# EAGLE design EPS Flatsat Module (EAGLE 9.5.1)

## Sheet 1 of 2
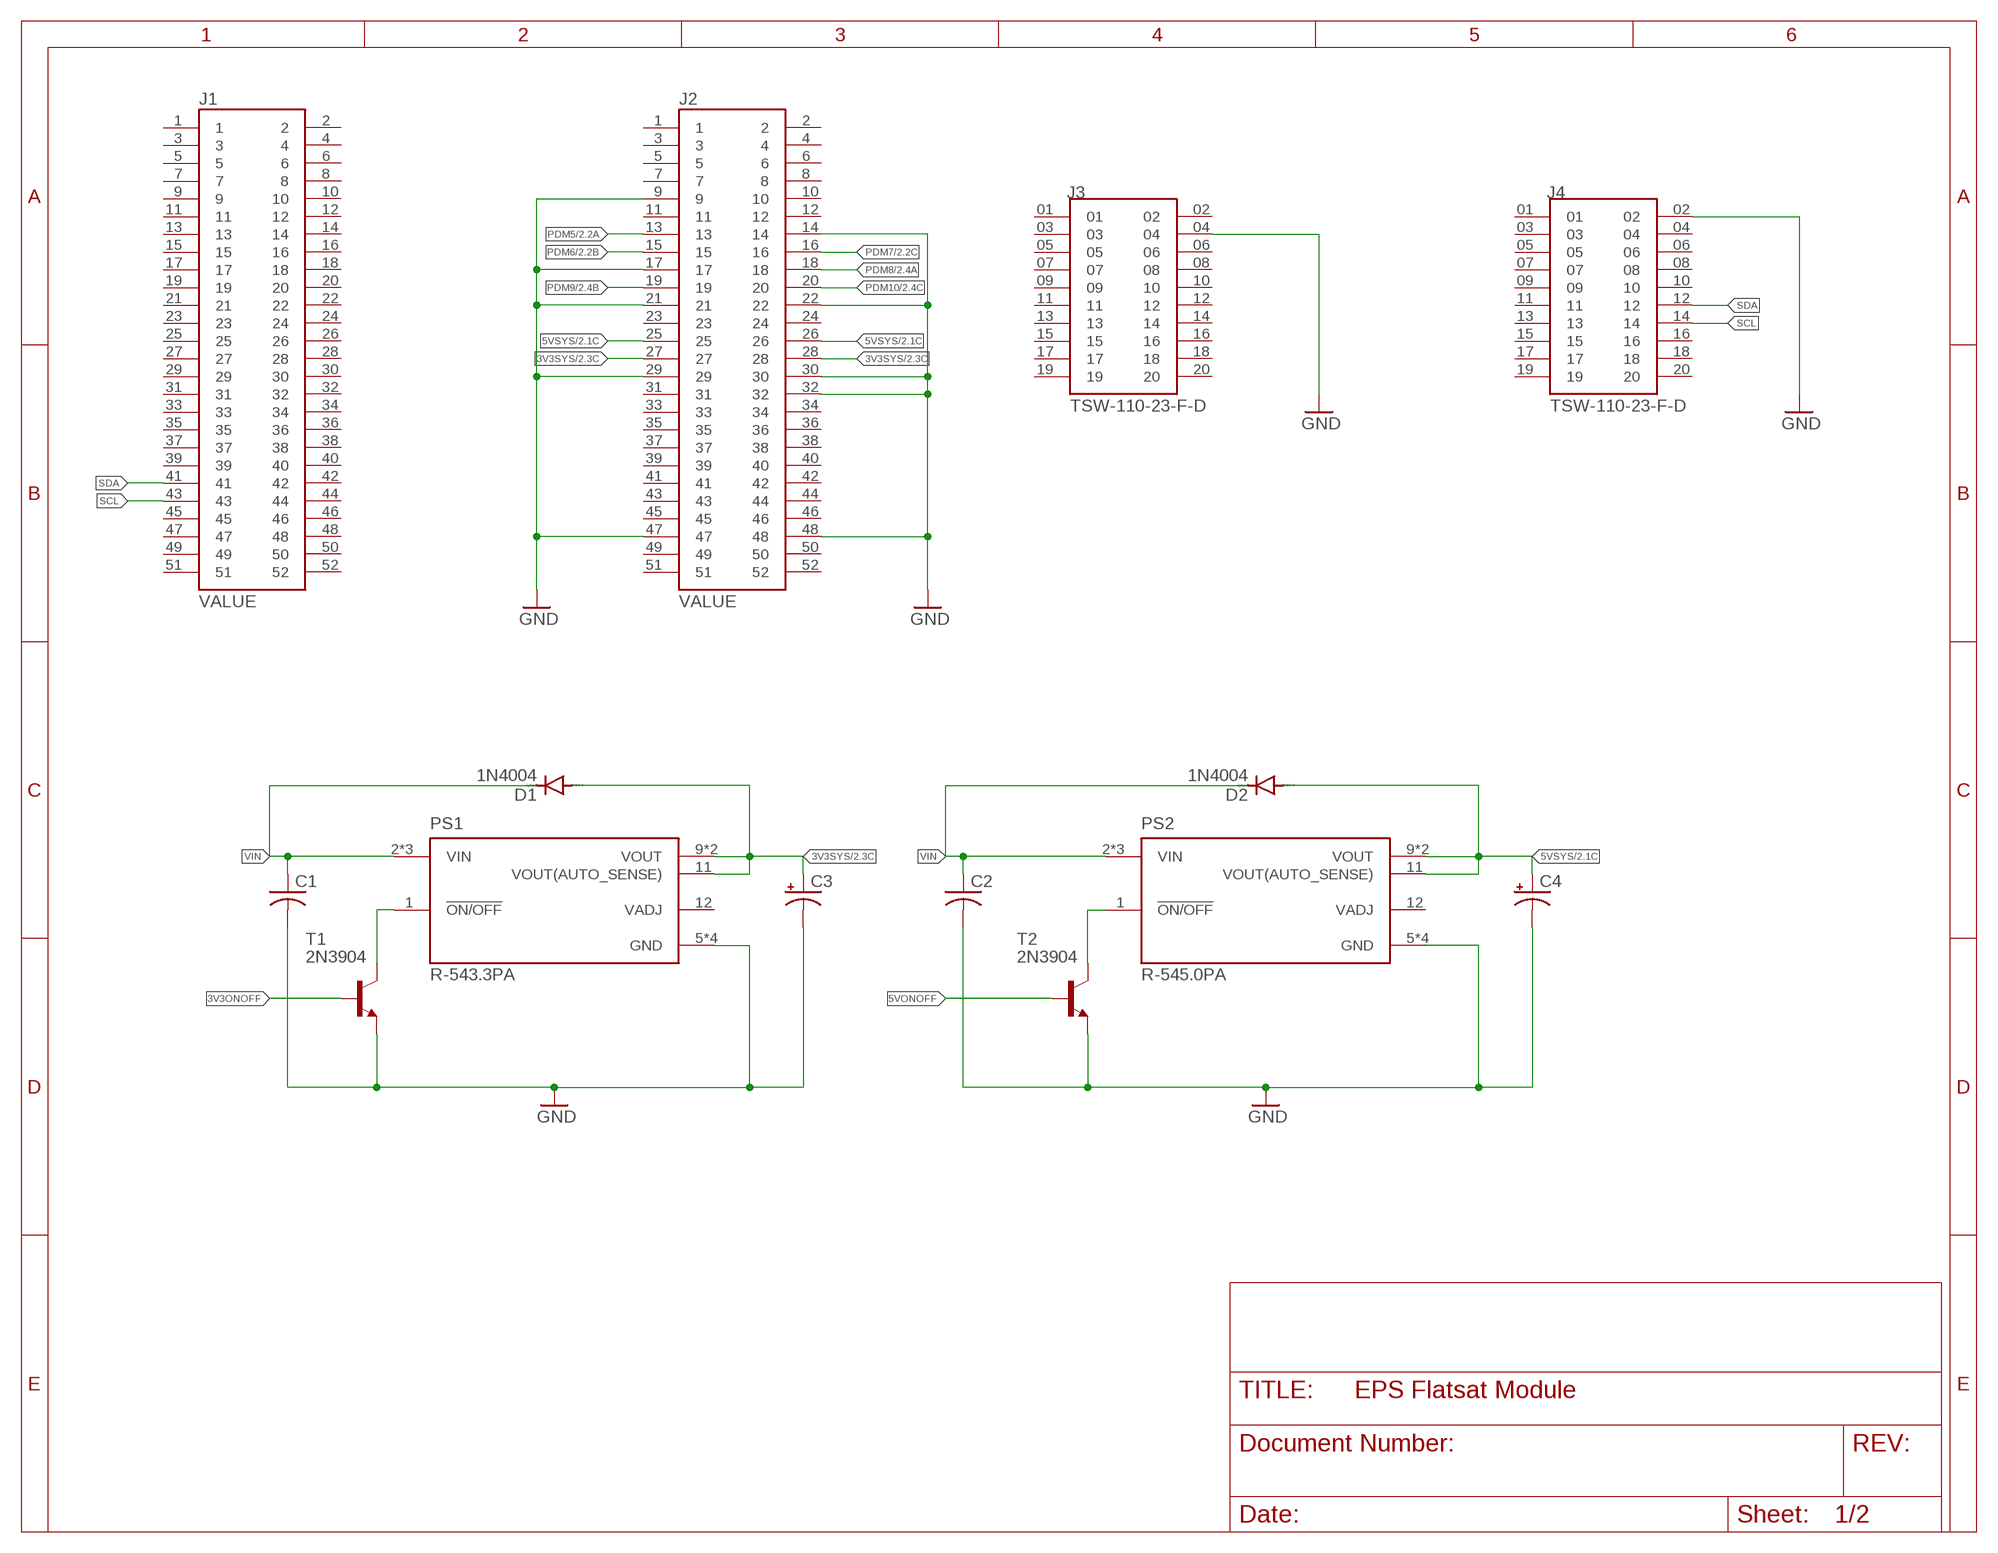
[diagram p0: schematic, sheet 1]

### Parts
C1  C-USC0805  [C0805]
C2  C-USC0805  [C0805]
C3  CPOL-USE2.5-6  [E2,5-6]
C4  CPOL-USE2.5-6  [E2,5-6]
D1  1N4004  [DO41-10]
D2  1N4004  [DO41-10]
J1  ESQ-126-39-G-D  [SAMTEC_ESQ-126-39-G-D]
J2  ESQ-126-39-G-D  [SAMTEC_ESQ-126-39-G-D]
J3  TSW-110-23-F-D  [SAMTEC_TSW-110-23-F-D]
J4  TSW-110-23-F-D  [SAMTEC_TSW-110-23-F-D]
PS1  R-543.3PA  [CONV_R-543.3PA]
PS2  R-545.0PA  [CONV_R-545.0PA]
T1  2N3904  [TO92]
T2  2N3904  [TO92]

### Nets
3V3ONOFF: T1.2(B)
3V3SYS: C3.+ D1.A J2.27 J2.28 PS1.9(VOUT) PS1.10(VOUT) PS1.11(VOUT(AUTO_SENSE)) ; also sheet 2
5VONOFF: T2.2(B)
5VSYS: C4.+ D2.A J2.25 J2.26 PS2.9(VOUT) PS2.10(VOUT) PS2.11(VOUT(AUTO_SENSE)) ; also sheet 2
GND: C1.2 C2.2 C3.- C4.- J2.9 J2.14 J2.17 J2.21 J2.22 J2.29 J2.30 J2.32 J2.47 J2.48 J3.04 J4.02 PS1.5(GND) PS1.6(GND) PS1.7(GND) PS1.8(GND) PS2.5(GND) PS2.6(GND) PS2.7(GND) PS2.8(GND) T1.3(E) T2.3(E) ; also sheet 2
N$1: PS1.1(!ON/OFF) T1.1(C)
N$2: PS2.1(!ON/OFF) T2.1(C)
PDM5: J2.13 ; also sheet 2
PDM6: J2.15 ; also sheet 2
PDM7: J2.16 ; also sheet 2
PDM8: J2.18 ; also sheet 2
PDM9: J2.19 ; also sheet 2
PDM10: J2.20 ; also sheet 2
SCL: J1.43 J4.14
SDA: J1.41 J4.12
VIN: C1.1 C2.1 D1.C D2.C PS1.2(VIN) PS1.3(VIN) PS1.4(VIN) PS2.2(VIN) PS2.3(VIN) PS2.4(VIN)
Unconnected: J1.1 J1.2 J1.3 J1.4 J1.5 J1.6 J1.7 J1.8 J1.9 J1.10 J1.11 J1.12 J1.13 J1.14 J1.15 J1.16 J1.17 J1.18 J1.19 J1.20 J1.21 J1.22 J1.23 J1.24 J1.25 J1.26 J1.27 J1.28 J1.29 J1.30 J1.31 J1.32 J1.33 J1.34 J1.35 J1.36 J1.37 J1.38 J1.39 J1.40 J1.42 J1.44 J1.45 J1.46 J1.47 J1.48 J1.49 J1.50 J1.51 J1.52 J2.1 J2.2 J2.3 J2.4 J2.5 J2.6 J2.7 J2.8 J2.10 J2.11 J2.12 J2.23 J2.24 J2.31 J2.33 J2.34 J2.35 J2.36 J2.37 J2.38 J2.39 J2.40 J2.41 J2.42 J2.43 J2.44 J2.45 J2.46 J2.49 J2.50 J2.51 J2.52 J3.01 J3.02 J3.03 J3.05 J3.06 J3.07 J3.08 J3.09 J3.10 J3.11 J3.12 J3.13 J3.14 J3.15 J3.16 J3.17 J3.18 J3.19 J3.20 J4.01 J4.03 J4.04 J4.05 J4.06 J4.07 J4.08 J4.09 J4.10 J4.11 J4.13 J4.15 J4.16 J4.17 J4.18 J4.19 J4.20 PS1.12(VADJ) PS2.12(VADJ)

## Sheet 2 of 2
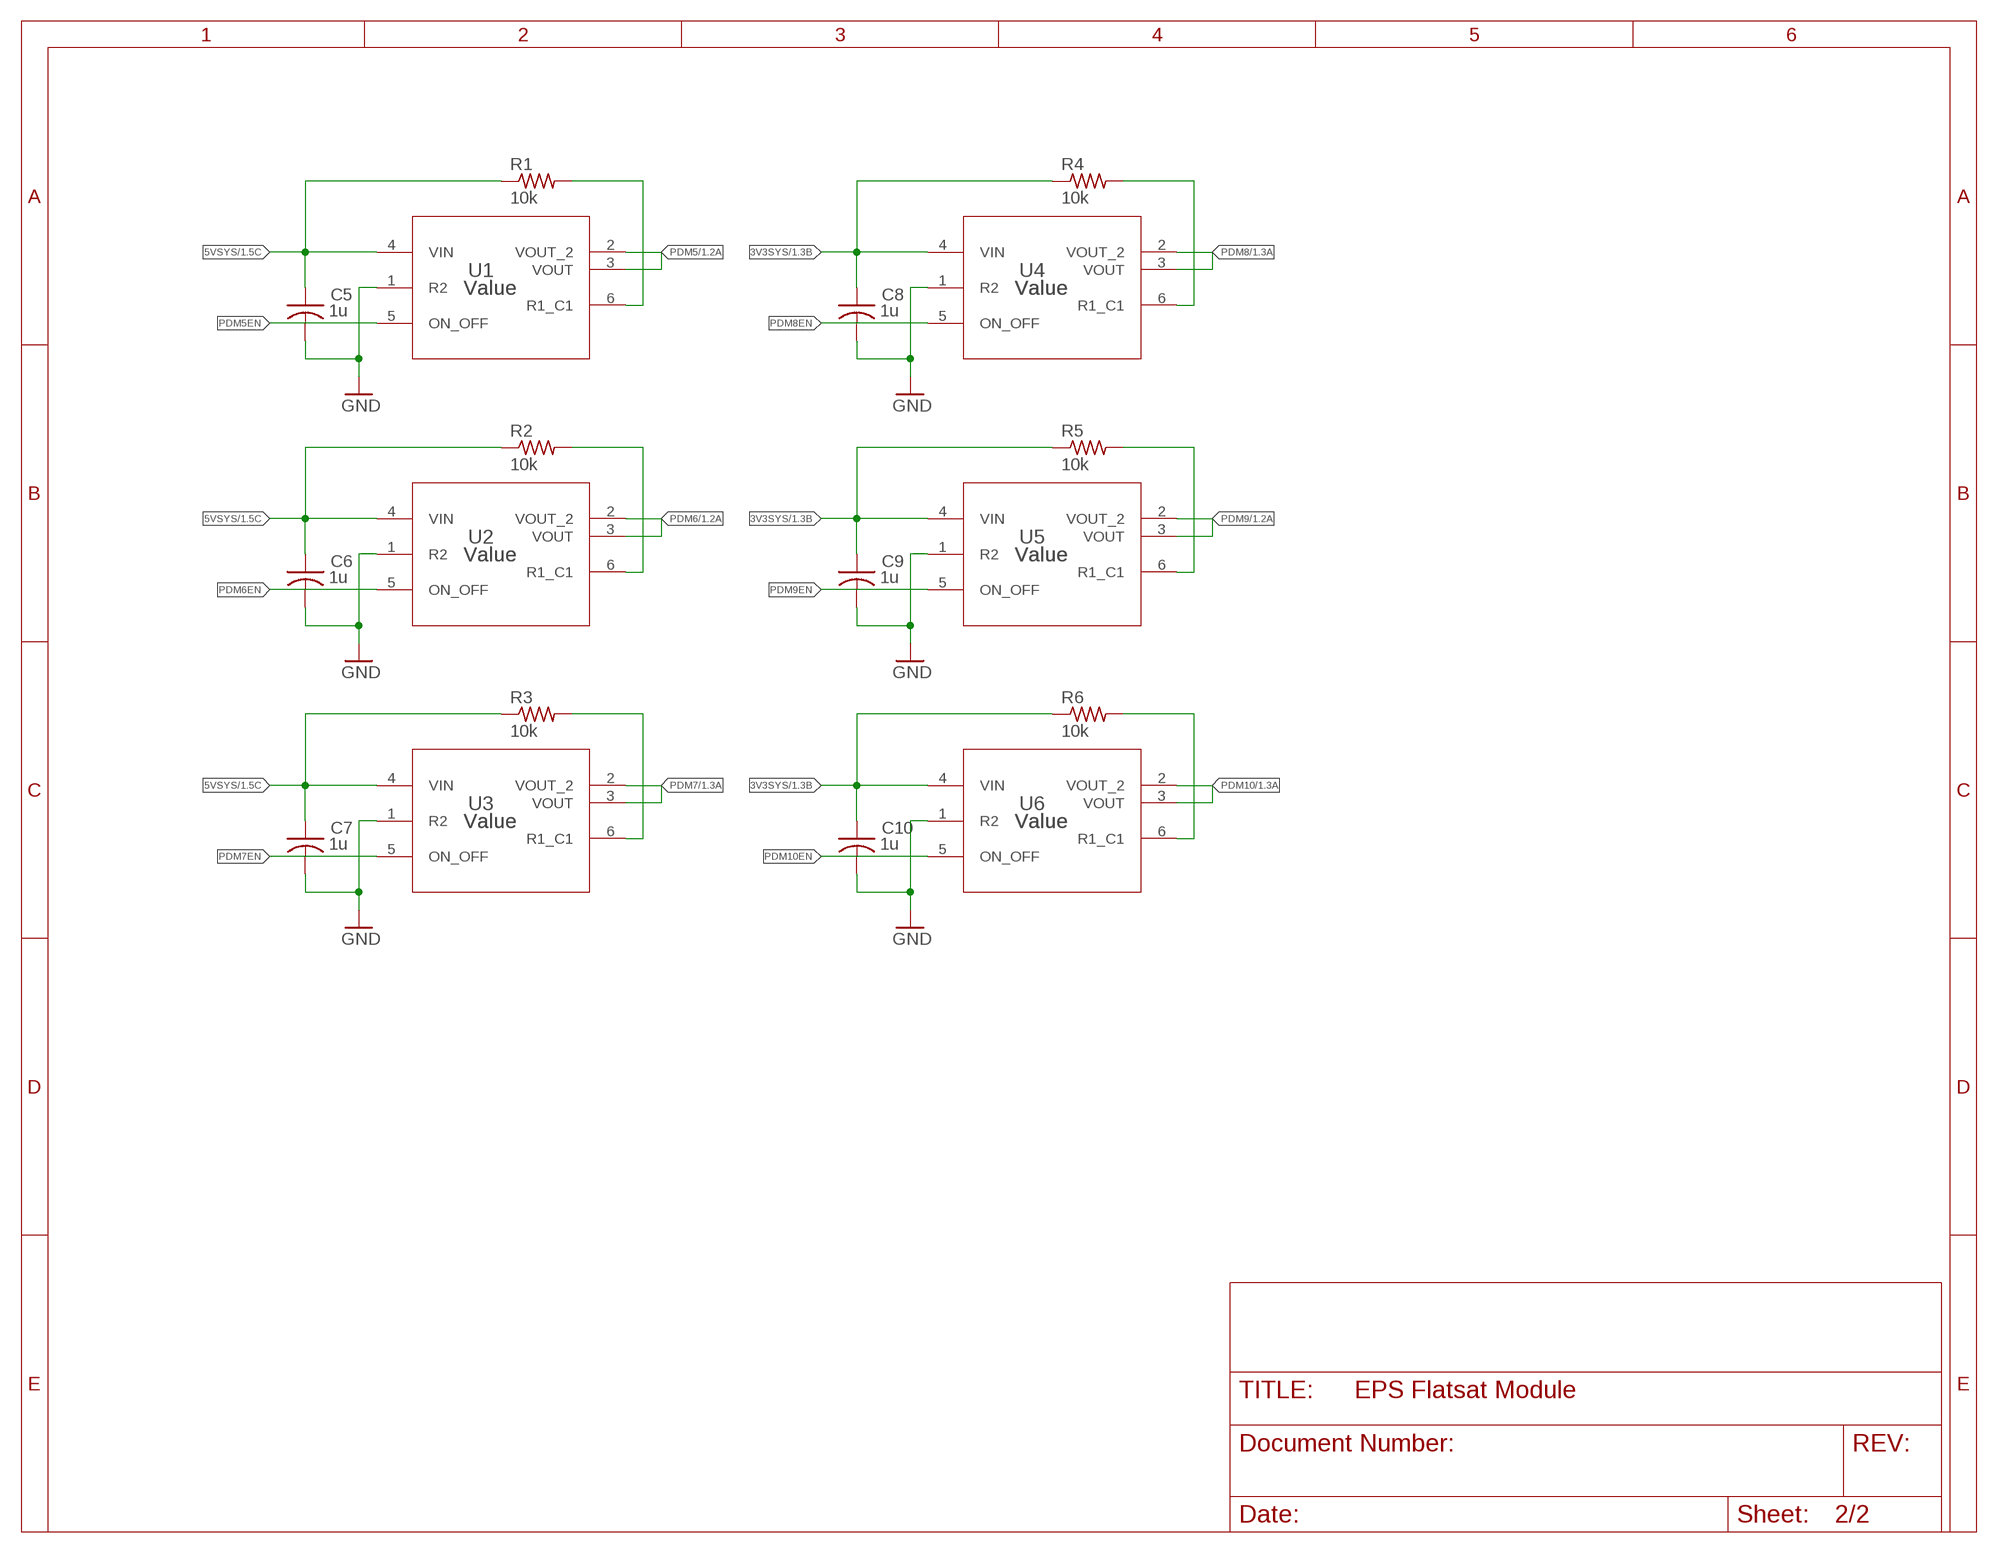
[diagram p1: schematic, sheet 2]

### Parts
C5  1u  C-USC0805  [C0805]
C6  1u  C-USC0805  [C0805]
C7  1u  C-USC0805  [C0805]
C8  1u  C-USC0805  [C0805]
C9  1u  C-USC0805  [C0805]
C10  1u  C-USC0805  [C0805]
R1  10k  R-US_R0805  [R0805]
R2  10k  R-US_R0805  [R0805]
R3  10k  R-US_R0805  [R0805]
R4  10k  R-US_R0805  [R0805]
R5  10k  R-US_R0805  [R0805]
R6  10k  R-US_R0805  [R0805]
U1  Value  TPS27081ADDCR  [DDC0006A_N]
U2  Value  TPS27081ADDCR  [DDC0006A_N]
U3  Value  TPS27081ADDCR  [DDC0006A_N]
U4  Value  TPS27081ADDCR  [DDC0006A_N]
U5  Value  TPS27081ADDCR  [DDC0006A_N]
U6  Value  TPS27081ADDCR  [DDC0006A_N]

### Nets
3V3SYS: C8.1 C9.1 C10.1 R4.1 R5.1 R6.1 U4.4(VIN) U5.4(VIN) U6.4(VIN) ; also sheet 1
5VSYS: C5.1 C6.1 C7.1 R1.1 R2.1 R3.1 U1.4(VIN) U2.4(VIN) U3.4(VIN) ; also sheet 1
GND: C5.2 C6.2 C7.2 C8.2 C9.2 C10.2 U1.1(R2) U2.1(R2) U3.1(R2) U4.1(R2) U5.1(R2) U6.1(R2) ; also sheet 1
N$3: R1.2 U1.6(R1_C1)
N$4: R2.2 U2.6(R1_C1)
N$5: R3.2 U3.6(R1_C1)
N$6: R4.2 U4.6(R1_C1)
N$7: R5.2 U5.6(R1_C1)
N$8: R6.2 U6.6(R1_C1)
PDM5: U1.2(VOUT_2) U1.3(VOUT) ; also sheet 1
PDM5EN: U1.5(ON_OFF)
PDM6: U2.2(VOUT_2) U2.3(VOUT) ; also sheet 1
PDM6EN: U2.5(ON_OFF)
PDM7: U3.2(VOUT_2) U3.3(VOUT) ; also sheet 1
PDM7EN: U3.5(ON_OFF)
PDM8: U4.2(VOUT_2) U4.3(VOUT) ; also sheet 1
PDM8EN: U4.5(ON_OFF)
PDM9: U5.2(VOUT_2) U5.3(VOUT) ; also sheet 1
PDM9EN: U5.5(ON_OFF)
PDM10: U6.2(VOUT_2) U6.3(VOUT) ; also sheet 1
PDM10EN: U6.5(ON_OFF)

## Library data of the parts
C1 C2 C5-C10 = rcl:C-US: CAPACITOR, American symbol; SPICEPREFIX: C
C3 C4 = rcl:CPOL-US: POLARIZED CAPACITOR, American symbol; SPICEPREFIX: C
D1 D2 = diode:1N4004: DIODE general purpose rectifier, 1 A
J1 J2 = ESQ-126-39-G-D:ESQ-126-39-G-D: Conn Elevated Socket SKT 52 POS 2.54mm Solder ST Thru-Hole Tube; DESCRIPTION: 52 Position Elevated Socket Connector Through Hole; DIGI-KEY_PART_NUMBER: SAM10462-ND; DIGI-KEY_PURCHASE_URL: https://www.digikey.com/product-detail/en/samtec-inc/ESQ-126-39-G-D/SAM10462-ND/3601055?utm_source=snapeda&utm_medium=aggregator&utm_campaign=symbol; MF: Samtec; MP: ESQ-126-39-G-D; PACKAGE: None
J3 J4 = TSW-110-23-F-D:TSW-110-23-F-D; MANUFACTURER: Samtec; PARTREV: R; STANDARD: Manufacturer Recommendations
PS1 = R-543.3PA:R-543.3PA: 2,3,4,5 Amp SIP12 Vertical & Horizontal Single Output; DESCRIPTION: 4A DC/DC-Converter 'INNOLINE' SIP12 reg; DIGI-KEY_PART_NUMBER: 945-1599-5-ND; DIGIKEY-PURCHASE-URL: https://snapeda.com/shop?store=DigiKey&id=3630570; MF: Recom Power; MP: R-543.3PA; PACKAGE: SIP-12 Recom Power
PS2 = R-545.0PA:R-545.0PA: 2,3,4,5 Amp SIP12 Vertical & Horizontal Single Output; DESCRIPTION: 4A DC/DC-Converter 'INNOLINE' SIP12 reg; DIGI-KEY_PART_NUMBER: R-545.0PA-ND; MF: Recom Power; MP: R-545.0PA; PACKAGE: SIP-12 Recom Power
R1-R6 = rcl:R-US_: RESISTOR, American symbol; SPICEPREFIX: R
T1 T2 = transistor:2N3904: NPN TRANSISTOR
U1-U6 = TPS27081ADDCR:TPS27081ADDCR; APPLICATION_BUILDNUMBER: *; COMPTYPE: IC; MANUFACTURER: Texas Instruments; MOUNTTYPE: SMT; PACKAGEREFERENCE: DDC0006A; PARTNUMBER: TPS27081ADDCR; PIN_COUNT: 6; REFDES: RefDes; ROHS: Y; TYPE: TYPE

## Board
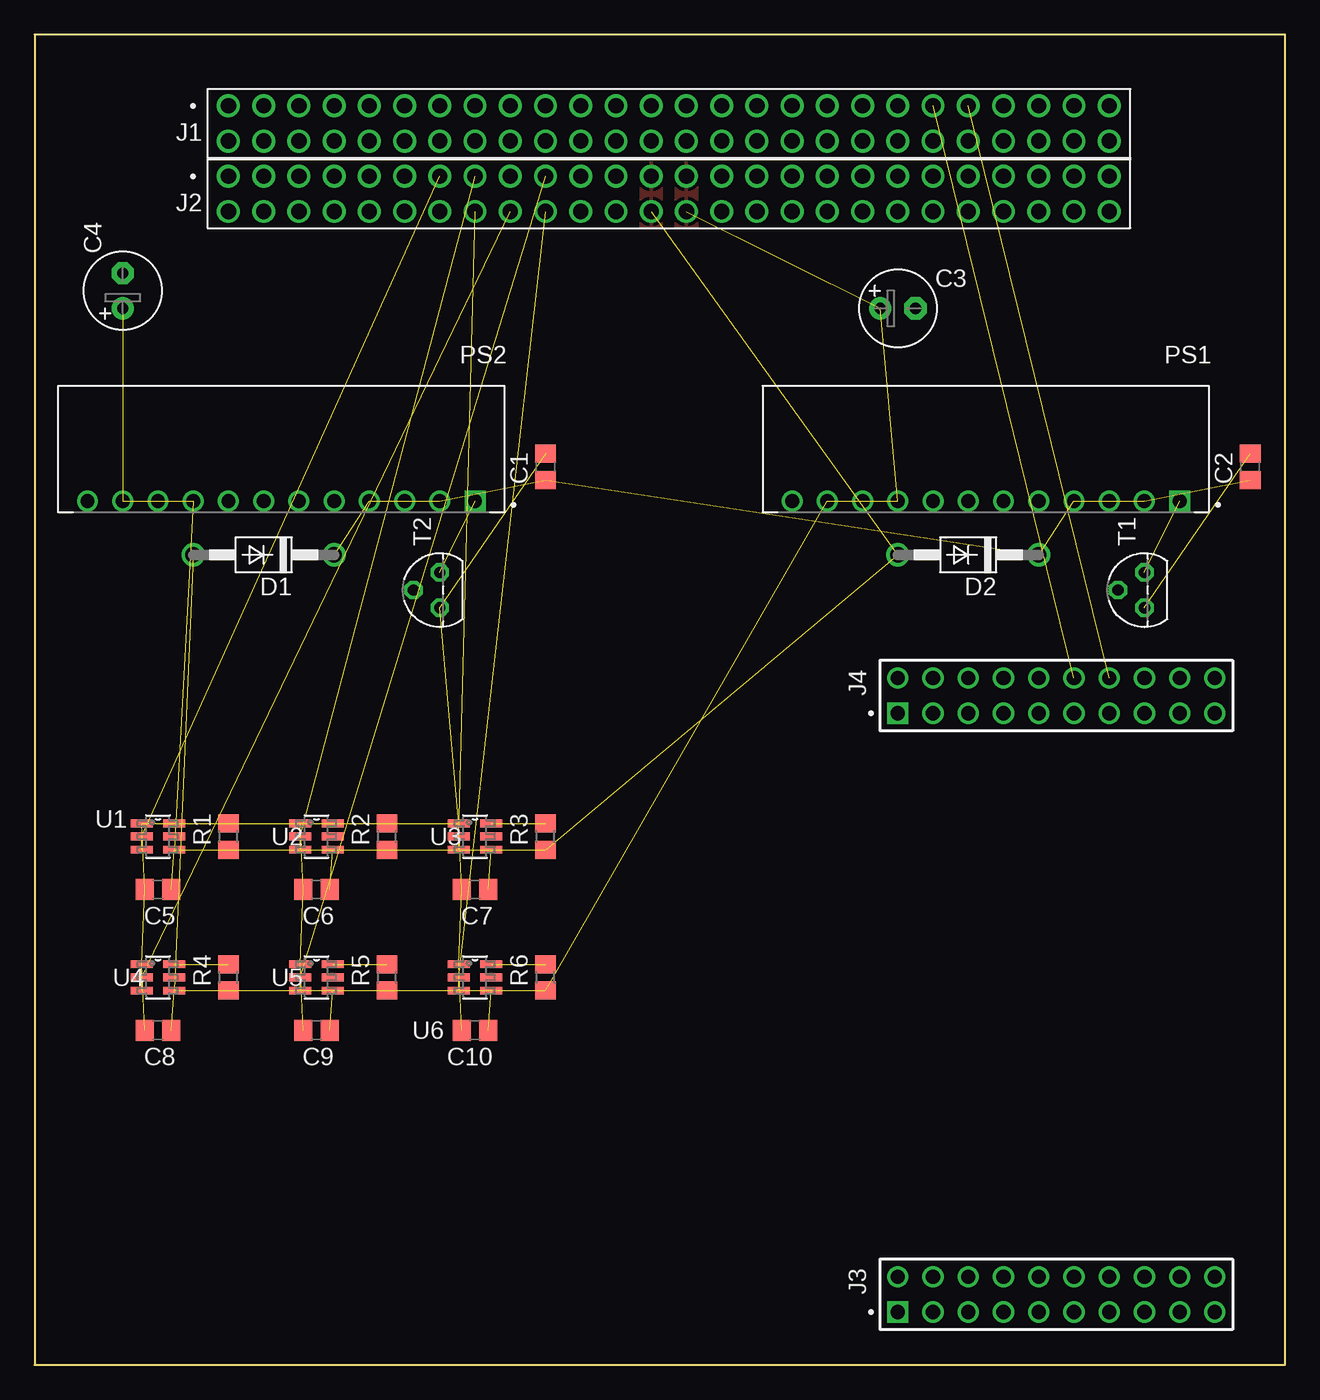
[diagram p2: board, top side]
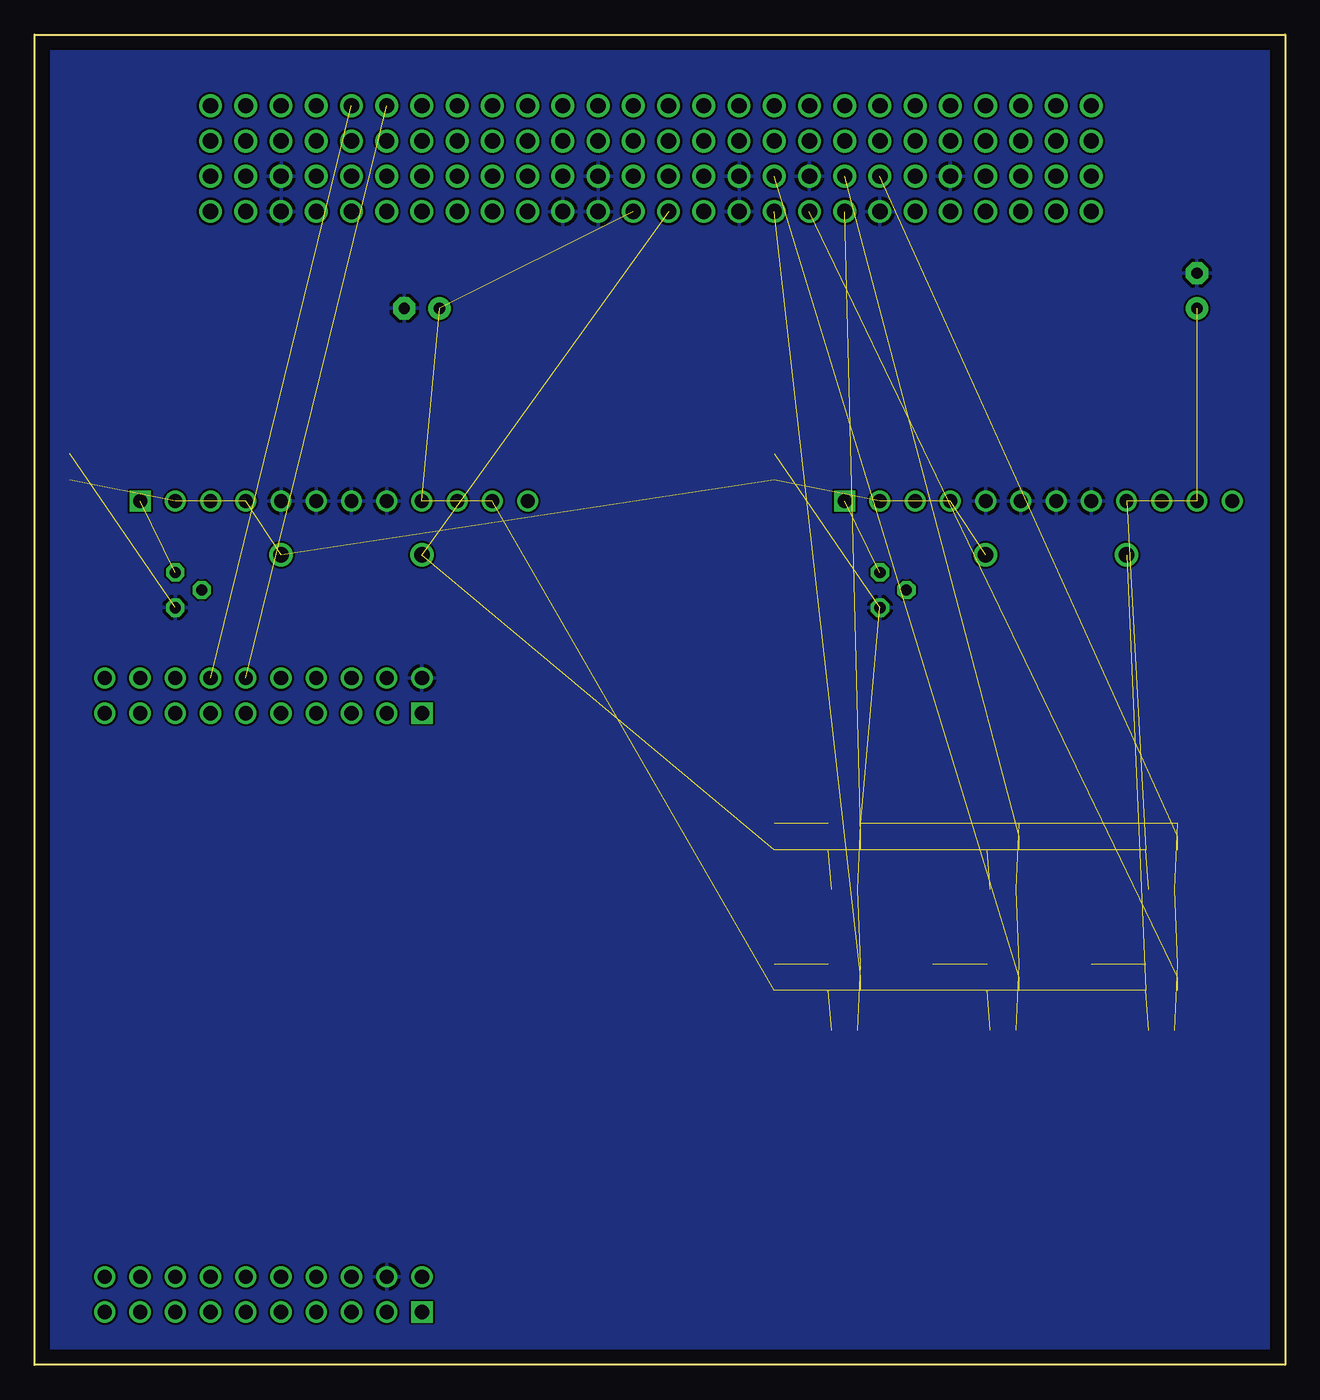
[diagram p3: board, bottom side, seen from below]

Size 90.15 x 95.94 mm. Coordinates in mm from the lower left corner, seen from the top.
Outline: 0,95.94 0,0 90.15,0 90.15,95.94 0,95.94
Copper layers (1*16): Top 0.035mm / dielectric 1.5mm / Bottom 0.035mm
Design rules "default": minimum track width 6mil, minimum drill 0.35mm, track to track 6mil, track to pad 6mil, pad to pad 6mil, via to via 6mil, smd to smd 6mil, copper to edge 40mil, drill to drill 6mil, minimum pad ring 10mil, minimum via ring 8mil, stop-mask expansion 4mil, vias tented up to drill 0mil, thermal gap 10mil

### Footprints (pad centres in the part's own frame; a part is rotated, then mirrored left to right if it is on the bottom)
C0805 = smd 1.3 x 1.5: 1 -0.95,0; 2 0.95,0
E2,5-6 = drill 0.813 pad 1.6: + -1.27,0 | drill 0.813 pad 1.6 octagon: - 1.27,0
DO41-10 = drill 1.118: A 5.08,0; C -5.08,0
SAMTEC_ESQ-126-39-G-D = drill 1.1: 1 0,0; 2 0,-2.54; 3 2.54,0; 4 2.54,-2.54; 5 5.08,0; 6 5.08,-2.54; 7 7.62,0; 8 7.62,-2.54; 9 10.16,0; 10 10.16,-2.54; 11 12.7,0; 12 12.7,-2.54; 13 15.24,0; 14 15.24,-2.54; 15 17.78,0; 16 17.78,-2.54; 17 20.32,0; 18 20.32,-2.54; 19 22.86,0; 20 22.86,-2.54; 21 25.4,0; 22 25.4,-2.54; 23 27.94,0; 24 27.94,-2.54; 25 30.48,0; 26 30.48,-2.54; 27 33.02,0; 28 33.02,-2.54; 29 35.56,0; 30 35.56,-2.54; 31 38.1,0; 32 38.1,-2.54; 33 40.64,0; 34 40.64,-2.54; 35 43.18,0; 36 43.18,-2.54; 37 45.72,0; 38 45.72,-2.54; 39 48.26,0; 40 48.26,-2.54; 41 50.8,0; 42 50.8,-2.54; 43 53.34,0; 44 53.34,-2.54; 45 55.88,0; 46 55.88,-2.54; 47 58.42,0; 48 58.42,-2.54; 49 60.96,0; 50 60.96,-2.54; 51 63.5,0; 52 63.5,-2.54
SAMTEC_TSW-110-23-F-D = drill 1.02 pad 1.37 square: 01 0,0 | drill 1.02 pad 1.37: 02 0,2.54; 03 2.54,0; 04 2.54,2.54; 05 5.08,0; 06 5.08,2.54; 07 7.62,0; 08 7.62,2.54; 09 10.16,0; 10 10.16,2.54; 11 12.7,0; 12 12.7,2.54; 13 15.24,0; 14 15.24,2.54; 15 17.78,0; 16 17.78,2.54; 17 20.32,0; 18 20.32,2.54; 19 22.86,0; 20 22.86,2.54
CONV_R-543.3PA = drill 1 square: 1 -13.97,3.75 | drill 1: 2 -11.43,3.75; 3 -8.89,3.75; 4 -6.35,3.75; 5 -3.81,3.75; 6 -1.27,3.75; 7 1.27,3.75; 8 3.81,3.75; 9 6.35,3.75; 10 8.89,3.75; 11 11.43,3.75; 12 13.97,3.75
CONV_R-545.0PA = drill 1 square: 1 -13.97,3.75 | drill 1: 2 -11.43,3.75; 3 -8.89,3.75; 4 -6.35,3.75; 5 -3.81,3.75; 6 -1.27,3.75; 7 1.27,3.75; 8 3.81,3.75; 9 6.35,3.75; 10 8.89,3.75; 11 11.43,3.75; 12 13.97,3.75
R0805 = smd 1.3 x 1.5: 1 -0.95,0; 2 0.95,0
TO92 = drill 0.813 octagon: 1 1.27,0; 2 0,1.905; 3 -1.27,0
DDC0006A_N = smd 1.575 x 0.559: 1 -1.168,0.95; 2 -1.168,0; 3 -1.168,-0.95; 4 1.168,-0.95; 5 1.168,0; 6 1.168,0.95

### Placement (x,y rotation side)
C1  36.83,64.77 90 top
C2  87.63,64.77 90 top
C3  62.23,76.2 0 top
C4  6.35,77.47 90 top
C5  8.89,34.29 180 top
C6  20.32,34.29 180 top
C7  31.75,34.29 180 top
C8  8.89,24.13 180 top
C9  20.32,24.13 180 top
C10  31.75,24.13 180 top
D1  16.51,58.42 180 top
D2  67.31,58.42 180 top
J1  13.97,90.81 0 top
J2  13.97,85.72 0 top
J3  62.23,3.81 0 top
J4  62.23,46.99 0 top
PS1  68.58,66.04 180 top
PS2  17.78,66.04 180 top
R1  13.97,38.1 90 top
R2  25.4,38.1 90 top
R3  36.83,38.1 90 top
R4  13.97,27.94 90 top
R5  25.4,27.94 90 top
R6  36.83,27.94 90 top
T1  80.01,55.88 90 top
T2  29.21,55.88 90 top
U1  8.89,38.1 0 top
U2  20.32,38.1 0 top
U3  31.75,38.1 0 top
U4  8.89,27.94 0 top
U5  20.32,27.94 0 top
U6  31.75,27.94 0 top

### Tracks (layer width: path | path; a pad name or v marks a point on that pad's centre or on a via)
3V3SYS  (14 unrouted)
  pour Top: 46.23,82.04 46.23,86.74 47.75,86.74 47.75,82.04
5VSYS  (14 unrouted)
  pour Top: 43.69,82.04 43.69,86.74 45.21,86.74 45.21,82.04
GND  (14 unrouted)
  pour Bottom: -6.35,100.33 104.14,100.33 104.14,19.05 104.14,-8.89 -8.89,-8.89 -8.89,100.33
N$1  (1 unrouted)
N$2  (1 unrouted)
N$3  (1 unrouted)
N$4  (1 unrouted)
N$5  (1 unrouted)
N$6  (1 unrouted)
N$7  (1 unrouted)
N$8  (1 unrouted)
PDM5  (2 unrouted)
PDM6  (2 unrouted)
PDM7  (2 unrouted)
PDM8  (2 unrouted)
PDM9  (2 unrouted)
PDM10  (2 unrouted)
SCL  (1 unrouted)
SDA  (1 unrouted)
VIN  (9 unrouted)